# Altium schematic sheet ENET.SchDoc: My title
size A3; Organization: University of California; Address1: 475 Portola Plaza; Address2: Los Angeles, CA 90095; DocumentNumber: 15; Revision: R01; SheetNumber: 15; SheetTotal: 35
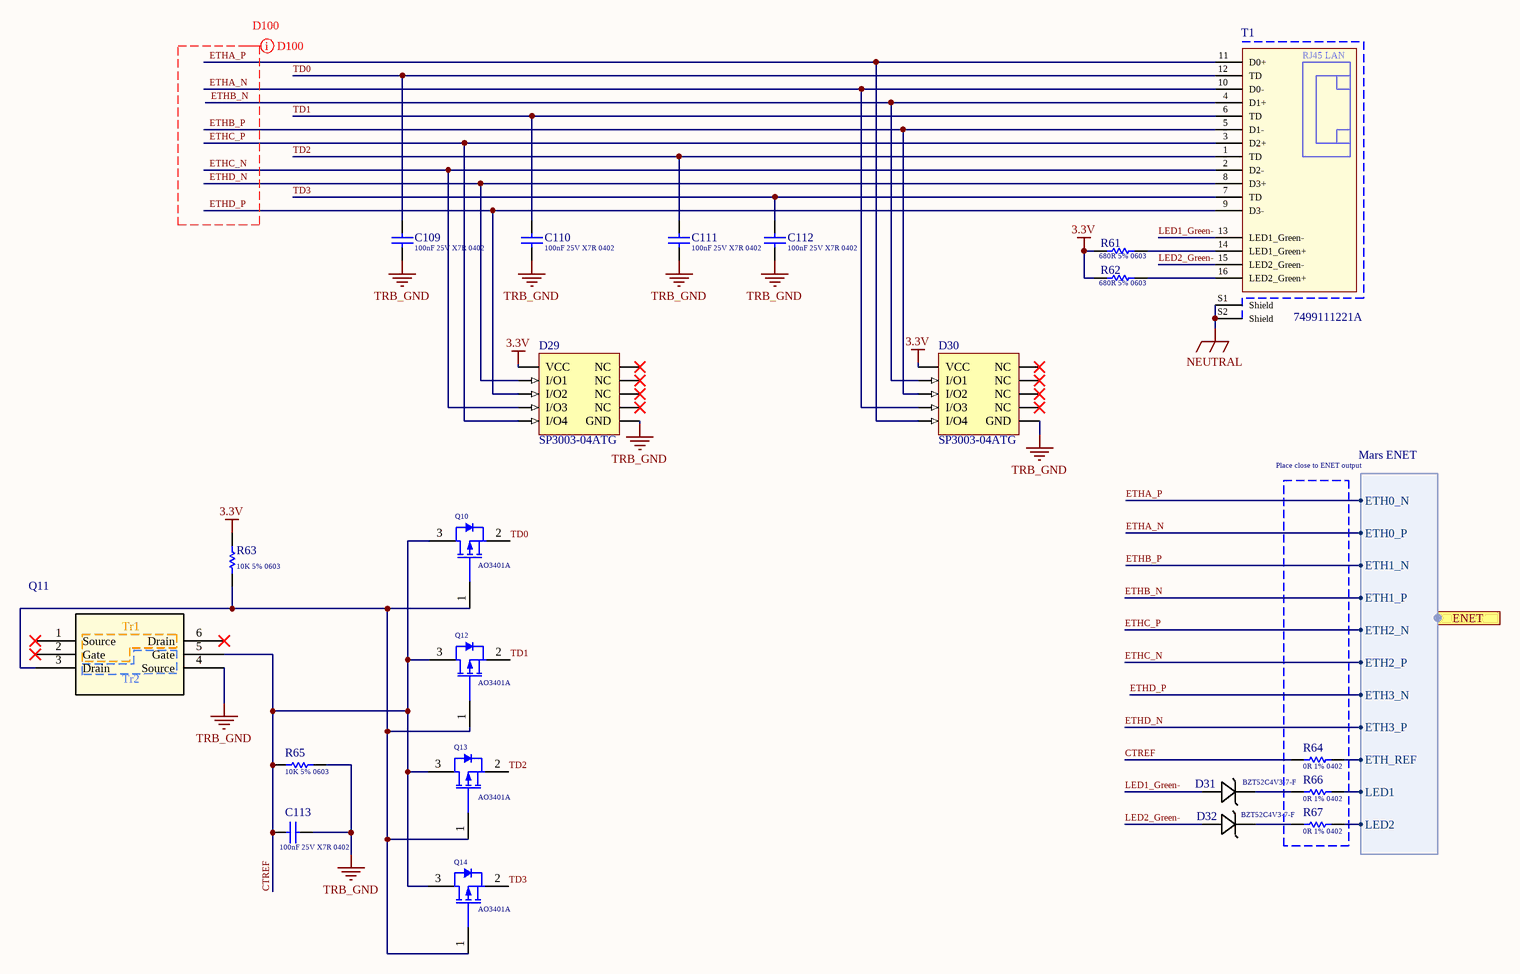
[diagram p0: ENET.SchDoc]

## Parts
C109  Capacitance: 100nF 25V X7R 0402  [Cap_Taiyo_Yuden_TMK105B7104KV-FR_100nF]  (hidden comment: Cap_Taiyo_Yuden_TMK105B7104KV-FR_100nF)
C110  Capacitance: 100nF 25V X7R 0402  [Cap_Taiyo_Yuden_TMK105B7104KV-FR_100nF]  (hidden comment: Cap_Taiyo_Yuden_TMK105B7104KV-FR_100nF)
C111  Capacitance: 100nF 25V X7R 0402  [Cap_Taiyo_Yuden_TMK105B7104KV-FR_100nF]  (hidden comment: Cap_Taiyo_Yuden_TMK105B7104KV-FR_100nF)
C112  Capacitance: 100nF 25V X7R 0402  [Cap_Taiyo_Yuden_TMK105B7104KV-FR_100nF]  (hidden comment: Cap_Taiyo_Yuden_TMK105B7104KV-FR_100nF)
C113  Capacitance: 100nF 25V X7R 0402  [Cap_Taiyo_Yuden_TMK105B7104KV-FR_100nF]  (hidden comment: Cap_Taiyo_Yuden_TMK105B7104KV-FR_100nF)
D29  Series: SP3003-04ATG  [Diode_SP3003-04ATG_LVDS_ESD]  (hidden comment: Diode_SP3003-04ATG_LVDS_ESD)
D30  Series: SP3003-04ATG  [Diode_SP3003-04ATG_LVDS_ESD]  (hidden comment: Diode_SP3003-04ATG_LVDS_ESD)
D31  BZT52C4V3-7-F  [SOD123]
D32  BZT52C4V3-7-F  [SOD123]
Q10  Series: AO3401A  [Mos_Alpha&Omega_AO3401A_4A]  (hidden comment: Mos_Alpha&Omega_AO3401A_4A)
Q11  EM6K6T2R  [TRANS_EM6_ROM]  (value not drawn)
Q12  Series: AO3401A  [Mos_Alpha&Omega_AO3401A_4A]  (hidden comment: Mos_Alpha&Omega_AO3401A_4A)
Q13  Series: AO3401A  [Mos_Alpha&Omega_AO3401A_4A]  (hidden comment: Mos_Alpha&Omega_AO3401A_4A)
Q14  Series: AO3401A  [Mos_Alpha&Omega_AO3401A_4A]  (hidden comment: Mos_Alpha&Omega_AO3401A_4A)
R61  680R 5% 0603  [RESC0603(1608)_L]
R62  680R 5% 0603  [RESC0603(1608)_L]
R63  10K 5% 0603  [RESC0603(1608)_L]
R64  Resistance: 0R 1% 0402  [Res_Vishay_CRCW04020000Z0EDC_0_Ohm]  (hidden comment: Res_Vishay_CRCW04020000Z0EDC_0_Ohm)
R65  10K 5% 0603  [RESC0603(1608)_L]
R66  Resistance: 0R 1% 0402  [Res_Vishay_CRCW04020000Z0EDC_0_Ohm]  (hidden comment: Res_Vishay_CRCW04020000Z0EDC_0_Ohm)
R67  Resistance: 0R 1% 0402  [Res_Vishay_CRCW04020000Z0EDC_0_Ohm]  (hidden comment: Res_Vishay_CRCW04020000Z0EDC_0_Ohm)
T1  7499111221A  [7499111221A]

## Ports
ENET (harness Mars ENET)

## Harnesses
Mars ENET: ETH0_P, ETH0_N, ETH1_P, ETH1_N, ETH2_P, ETH2_N, ETH3_P, ETH3_N, ETH_REF, LED1, LED2

## Nets
3.3V: D29.3(VCC) D30.3(VCC) R61.1 R62.1 R63.2
NEUTRAL: T1.S1(Shield) T1.S2(Shield)
TRB_GND: C109.1 C110.1 C111.1 C112.1 C113.1 D29.8(GND) D30.8(GND) Q11.4(Source) R65.1
CTREF: C113.2 Q10.3(D) Q11.5(Gate) Q12.3(D) Q13.3(D) Q14.3(D) R64.1 R65.2
ETHA_N: D30.4(I/O3) T1.10(D0-) ; port ENET.ETH0_P
ETHA_P: D30.5(I/O4) T1.11(D0+) ; port ENET.ETH0_N
ETHB_N: D30.1(I/O1) T1.4(D1+) ; port ENET.ETH1_P
ETHB_P: D30.2(I/O2) T1.5(D1-) ; port ENET.ETH1_N
ETHC_N: D29.4(I/O3) T1.2(D2-) ; port ENET.ETH2_P
ETHC_P: D29.5(I/O4) T1.3(D2+) ; port ENET.ETH2_N
ETHD_N: D29.1(I/O1) T1.8(D3+) ; port ENET.ETH3_P
ETHD_P: D29.2(I/O2) T1.9(D3-) ; port ENET.ETH3_N
LED1_Green-: D31.2 T1.13(LED1_Green-)
LED2_Green-: D32.2 T1.15(LED2_Green-)
TD0: C109.2 Q10.2(S) T1.12(TD)
TD1: C110.2 Q12.2(S) T1.6(TD)
TD2: C111.2 Q13.2(S) T1.1(TD)
TD3: C112.2 Q14.2(S) T1.7(TD)
NetD31_1: D31.1 R66.1
NetD32_1: D32.1 R67.1
NetQ10_1: Q10.1(G) Q11.3(Drain) Q12.1(G) Q13.1(G) Q14.1(G) R63.1
NetR61_2: R61.2 T1.14(LED1_Green+)
NetR62_2: R62.2 T1.16(LED2_Green+)
NetR64_2: R64.2 ; port ENET.ETH_REF
NetR66_2: R66.2 ; port ENET.LED1
NetR67_2: R67.2 ; port ENET.LED2

Not connected (* = marked no-connect by the designer): D29 6(NC)* 7(NC)* 9(NC)* 10(NC)*; D30 6(NC)* 7(NC)* 9(NC)* 10(NC)*; Q11 1(Source)* 2(Gate)* 6(Drain)*

## Layout directives
differential pair; differential pair class D100; rule Differential Pairs Routing [Pref Gap = 10mil    Min Gap  = 5mil    Max Gap  = 10milPref Width = 15mil    Min Width  = 3.244mil    Max Width  = 15mil]: ETHA_N, ETHA_P, ETHB_N, ETHB_P, ETHC_N, ETHC_P, ETHD_N, ETHD_P

## Notes on the sheet
- D100
- Place close to ENET output
- 475 Portola Plaza
- GAPS TOF
- igarcia91@g.ucla.edu
- Los Angeles, CA
- 310-825-0344
- Size:
- Date:
- Letter
- Revision:
- Time:
- Sheet
- of
- andrew.peck@cern.ch
- spq@ucla.edu
- File:
- (in symbol 7499111221A) RJ45 LAN
- (in symbol EM6K6T2R) Tr1; Tr2

## Library data of the parts
C109-C113 = Cap_Taiyo_Yuden_TMK105B7104KV-FR_100nF: CAP CER 100nF 25V X7R 0402; Supplier 1: Mouser; Supplier Part Number 1: 963-TMK105B7104KV-FR
D29 D30 = Diode_SP3003-04ATG_LVDS_ESD: ESD Suppressors / TVS Diodes 4 Ch 8kV 0.65pF SPA; Supplier 1: Mouser; Supplier Part Number 1: 576-SP3003-04ATG
D31 D32 = BZT52C4V3-7-F: Zener Diodes 500mW 4.3V Zener AEC-Q101 Qualified; Vendor: Diodes Inc; Built_By: EMA_UL_Team; Type: DEV; C: Copyright (C) 2015 Accelerated Designs. All rights reserved; Manufacturer_Part_Number: BZT52C4V3-7-F; RefDes: RefDes; Supplier 1: Mouser; Supplier Part Number 1: 621-BZT52C4V3-F; Series: BZT52C4V3-7-F
Q10 Q12-Q14 = Mos_Alpha&Omega_AO3401A_4A: P-Channel 30V 4A (Ta) 1.4W (Ta) Surface Mount SOT-23-3L; Supplier 1: Digi-key; Supplier Part Number 1: 785-1001-1-ND
Q11 = EM6K6T2R: MOSFET Small Signal Dual N-CH 20V .3A .15W; Vendor: ROHM Semiconductor; Manufacturer_Part_Number: EM6K6T2R
R61 R62 = CMP-1012-00070-1: 680R 0.1W 5% 0603 (1608 Metric)  SMD; Case-EIA: 0603; Value: 680.00 Ohm; Case-Metric: 1608; Tolerance: 5 %; Technology: SMT; Power: 0.1 W
R63 R65 = CMP-1012-00098-1: 10K 0.1W 5% 0603 (1608 Metric)  SMD; Case-EIA: 0603; Value: 10000.00 Ohm; Case-Metric: 1608; Technology: SMT; Tolerance: 5 %; Power: 0.1 W
R64 R66 R67 = Res_Vishay_CRCW04020000Z0EDC_0_Ohm: 0R 0.062W 1% 0402 (1005 Metric)  SMD; Supplier 1: Mouser; Supplier Part Number 1: 71-CRCW04020000Z0EDC
T1 = 7499111221A: WE-RJ45 LAN Transformer, 10/100/1000 Base-T, THT, Port 1x1, Tab Up; PoE: non-PoE; LED (Left-Right): green-green; USB: No; ComponentLink1Description: Manufacturer; ComponentLink1URL: http://www.we-online.de; ComponentLink2Description: Datasheet; ComponentLink2URL: http://katalog.we-online.de/pbs/datasheet/7499111221A.pdf; Part Number: 7499111221A; Published Date: Dec. 2017; Publisher: Wurth Elektronik; Tab Position: Up; Port Number: 1x1; Data Rate: 10/100/1000 Base-T; Operating Temperature: 0 to +70 degC; Mounting Technology: THT; Supplier Part Number 1: 710-7499111221A; Supplier 1: Mouser